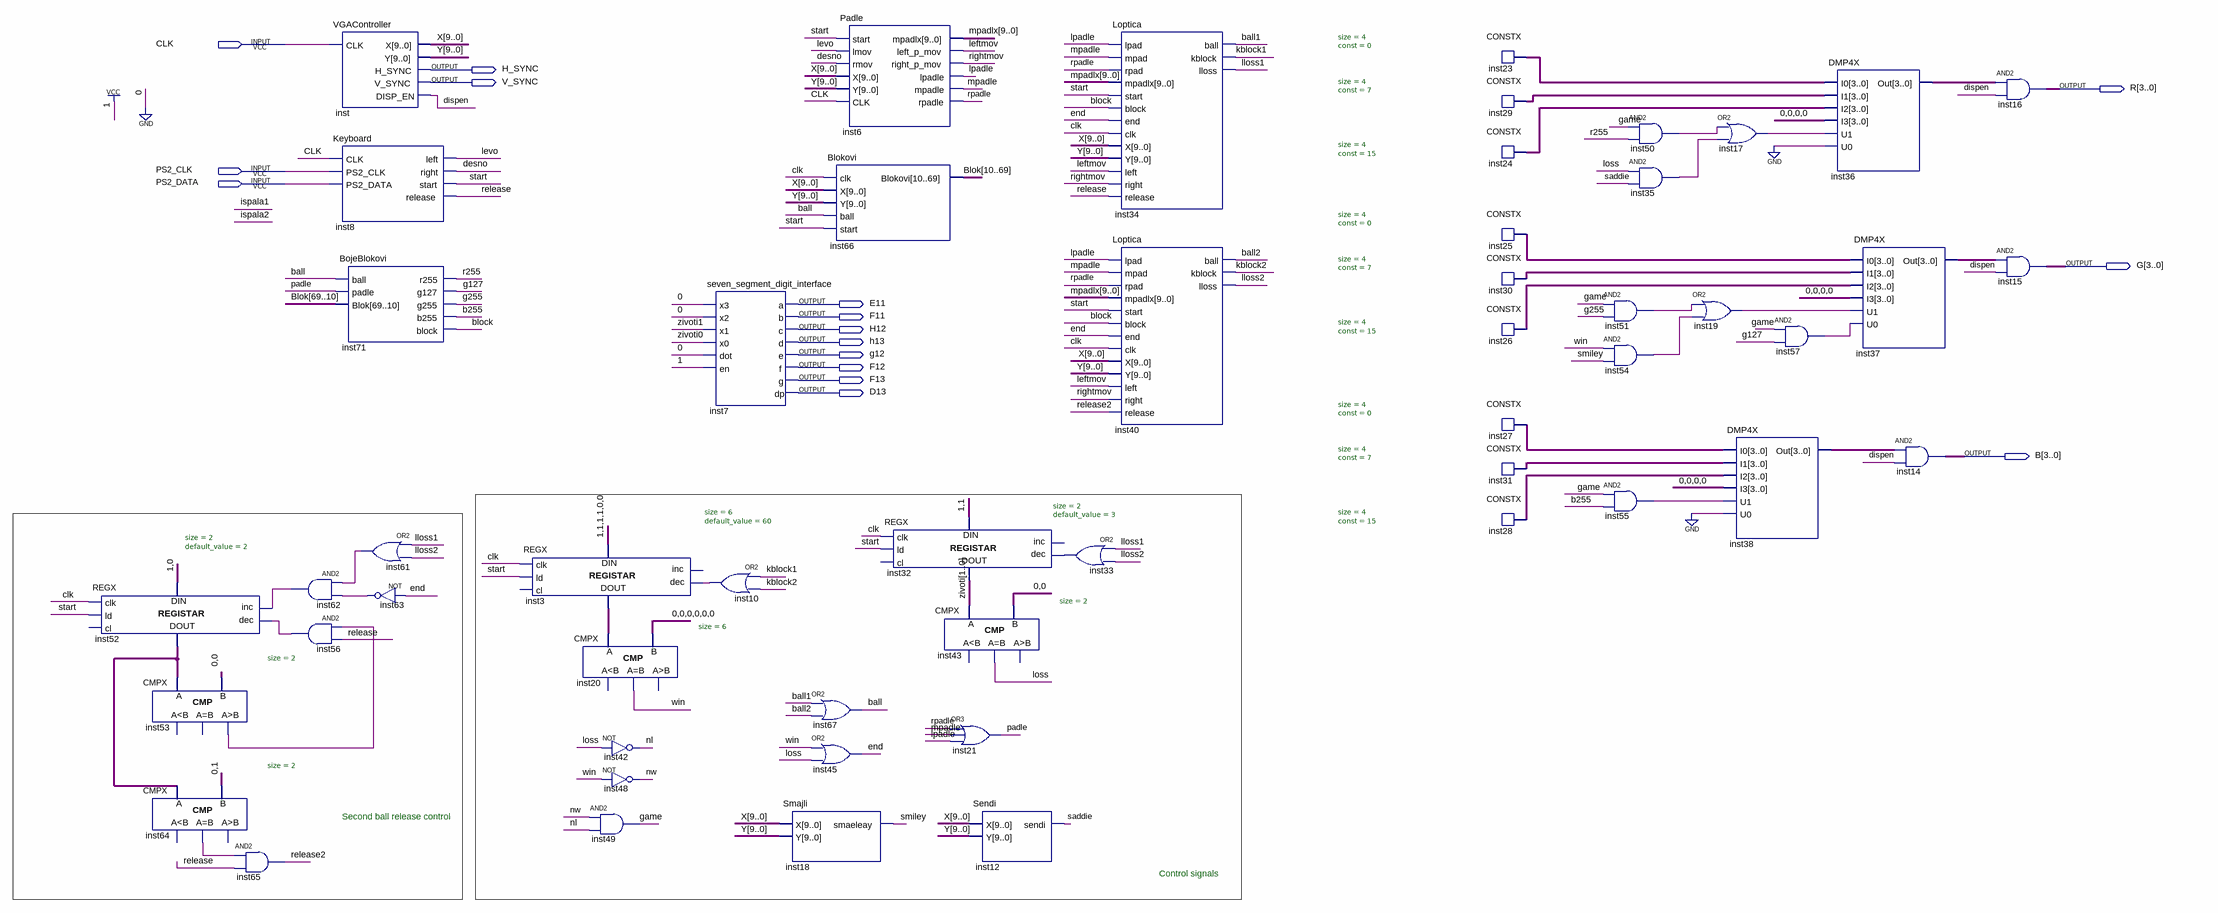
[diagram p0: schematic sheet]
// Quartus schematic BlockBreaker.bdf as structural Verilog: 53 symbols, 16 pins
module BlockBreaker (
  input  CLK,
  input  PS2_CLK,
  input  PS2_DATA,
  output H_SYNC,
  output V_SYNC,
  output [3:0] R,
  output [3:0] G,
  output E11,
  output F11,
  output H12,
  output h13,
  output g12,
  output F12,
  output F13,
  output D13,
  output [3:0] B
);

  wire b255, ball, ball1, ball2, block, desno, dispen, \end , g127, g255, game, inst10_out, inst17_out,
       inst19_out, inst33_out, inst35_out, inst50_out, inst51_out, inst53_gr, inst54_out, inst55_out,
       inst56_out, inst57_out, inst61_out, inst62_out, inst63_out, inst64_eq, kblock1, kblock2, leftmov,
       levo, lloss1, lloss2, loss, lpadle, mpadle, nl, nw, padle, r255, \release , release2, rightmov,
       rpadle, saddie, smiley, start, win;
  wire [1:0] inst52_data_out, zivoti;
  wire [3:0] inst23_data, inst24_data, inst25_data, inst26_data, inst27_data, inst28_data, inst29_data,
       inst30_data, inst31_data, inst36_out, inst37_out, inst38_out;
  wire [5:0] inst3_data_out;
  wire [9:0] mpadlx, X, Y;
  wire [69:10] Blok;

  REGX #(.size(2), .default_value(2)) inst52 (
    .clk(CLK), .ld(start), .inc(inst62_out), .dec(inst56_out), .data_in(2'b10), .data_out(inst52_data_out));  // open: cl
  CMPX #(.size(2)) inst53 (.A(inst52_data_out), .B(2'b00), .gr(inst53_gr));  // open: ls, eq
  CMPX #(.size(2)) inst64 (.A(inst52_data_out), .B(2'b01), .eq(inst64_eq));  // open: ls, gr
  and inst65 (release2, inst64_eq, \release );
  and inst62 (inst62_out, inst61_out, inst63_out);
  and inst56 (inst56_out, inst53_gr, \release );
  VGAController inst (.CLK(CLK), .X(X), .Y(Y), .H_SYNC(H_SYNC), .V_SYNC(V_SYNC), .DISP_EN(dispen));
  Keyboard inst8 (
    .CLK(CLK), .PS2_CLK(PS2_CLK), .PS2_DATA(PS2_DATA), .left(levo), .right(desno), .start(start),
    .\release (\release ));
  BojeBlokovi inst71 (
    .ball(ball), .padle(padle), .Blok(Blok), .r255(r255), .g127(g127), .g255(g255), .b255(b255), .block(block));
  or inst61 (inst61_out, lloss1, lloss2);
  not inst63 (inst63_out, \end );
  REGX #(.size(6), .default_value(60)) inst3 (
    .clk(CLK), .ld(start), .dec(inst10_out), .data_in(6'b111100), .data_out(inst3_data_out));  // open: cl, inc
  CMPX #(.size(6)) inst20 (.A(inst3_data_out), .B({6{1'b0}}), .eq(win));  // open: ls, gr
  not inst42 (nl, loss);
  not inst48 (nw, win);
  and inst49 (game, nw, nl);
  seven_segment_digit_interface inst7 (
    .x3(1'b0), .x2(1'b0), .x1(zivoti[1]), .x0(zivoti[0]), .dot(1'b0), .en(1'b1), .a(E11), .b(F11), .c(H12),
    .d(h13), .e(g12), .f(F12), .g(F13), .dp(D13));
  or inst10 (inst10_out, kblock1, kblock2);
  or inst67 (ball, ball1, ball2);
  or inst45 (\end , win, loss);
  Smajli inst18 (.X(X), .Y(Y), .smaeleay(smiley));
  Padle inst6 (
    .start(start), .lmov(levo), .rmov(desno), .X(X), .Y(Y), .CLK(CLK), .mpadlx(mpadlx), .left_p_mov(leftmov),
    .right_p_mov(rightmov), .lpadle(lpadle), .mpadle(mpadle), .rpadle(rpadle));
  Blokovi inst66 (
    .clk(CLK), .X(X), .Y(Y), .ball(ball), .start(start),
    .Blokovi({Blok[10], Blok[11], Blok[12], Blok[13], Blok[14], Blok[15], Blok[16], Blok[17], Blok[18], Blok[19], Blok[20], Blok[21], Blok[22], Blok[23], Blok[24], Blok[25], Blok[26], Blok[27], Blok[28], Blok[29], Blok[30], Blok[31], Blok[32], Blok[33], Blok[34], Blok[35], Blok[36], Blok[37], Blok[38], Blok[39], Blok[40], Blok[41], Blok[42], Blok[43], Blok[44], Blok[45], Blok[46], Blok[47], Blok[48], Blok[49], Blok[50], Blok[51], Blok[52], Blok[53], Blok[54], Blok[55], Blok[56], Blok[57], Blok[58], Blok[59], Blok[60], Blok[61], Blok[62], Blok[63], Blok[64], Blok[65], Blok[66], Blok[67], Blok[68], Blok[69]}));
  REGX #(.size(2), .default_value(3)) inst32 (
    .clk(CLK), .ld(start), .dec(inst33_out), .data_in(2'b11), .data_out(zivoti));  // open: cl, inc
  CMPX #(.size(2)) inst43 (.A(zivoti), .B(2'b00), .eq(loss));  // open: ls, gr
  or inst21 (padle, rpadle, mpadle, lpadle);
  Sendi inst12 (.X(X), .Y(Y), .sendi(saddie));
  or inst33 (inst33_out, lloss1, lloss2);
  Loptica inst34 (
    .lpad(lpadle), .mpad(mpadle), .rpad(rpadle), .mpadlx(mpadlx), .start(start), .block(block),
    .\end (\end ), .clk(CLK), .X(X), .Y(Y), .left(leftmov), .right(rightmov), .\release (\release ),
    .ball(ball1), .kblock(kblock1), .lloss(lloss1));
  Loptica inst40 (
    .lpad(lpadle), .mpad(mpadle), .rpad(rpadle), .mpadlx(mpadlx), .start(start), .block(block),
    .\end (\end ), .clk(CLK), .X(X), .Y(Y), .left(leftmov), .right(rightmov), .\release (release2),
    .ball(ball2), .kblock(kblock2), .lloss(lloss2));
  CONSTX #(.size(4), .\const (0)) inst23 (.data(inst23_data));
  CONSTX #(.size(4), .\const (7)) inst29 (.data(inst29_data));
  CONSTX #(.size(4), .\const (15)) inst24 (.data(inst24_data));
  CONSTX #(.size(4), .\const (0)) inst25 (.data(inst25_data));
  CONSTX #(.size(4), .\const (7)) inst30 (.data(inst30_data));
  CONSTX #(.size(4), .\const (15)) inst26 (.data(inst26_data));
  CONSTX #(.size(4), .\const (0)) inst27 (.data(inst27_data));
  CONSTX #(.size(4), .\const (7)) inst31 (.data(inst31_data));
  CONSTX #(.size(4), .\const (15)) inst28 (.data(inst28_data));
  and inst50 (inst50_out, game, r255);
  and inst35 (inst35_out, loss, saddie);
  and inst51 (inst51_out, game, g255);
  and inst54 (inst54_out, win, smiley);
  and inst55 (inst55_out, game, b255);
  or inst17 (inst17_out, inst50_out, inst35_out);
  or inst19 (inst19_out, inst51_out, inst54_out);
  DMP4X inst38 (
    .I0(inst27_data), .I1(inst31_data), .I2(inst28_data), .I3(4'b0000), .U1(inst55_out), .U0(1'b0),
    .Out(inst38_out));
  and inst57 (inst57_out, game, g127);
  DMP4X inst36 (
    .I0(inst23_data), .I1(inst29_data), .I2(inst24_data), .I3(4'b0000), .U1(inst17_out), .U0(1'b0),
    .Out(inst36_out));
  DMP4X inst37 (
    .I0(inst25_data), .I1(inst30_data), .I2(inst26_data), .I3(4'b0000), .U1(inst19_out), .U0(inst57_out),
    .Out(inst37_out));
  assign B = inst38_out & {4{dispen}};  // AND2 inst14, 4 bits wide
  assign R = inst36_out & {4{dispen}};  // AND2 inst16, 4 bits wide
  assign G = inst37_out & {4{dispen}};  // AND2 inst15, 4 bits wide

  // Notes on the sheet:
  //   Second ball release control
  //   Control signals
endmodule
